# EAGLE design MidiWah (EAGLE 7.1.0)
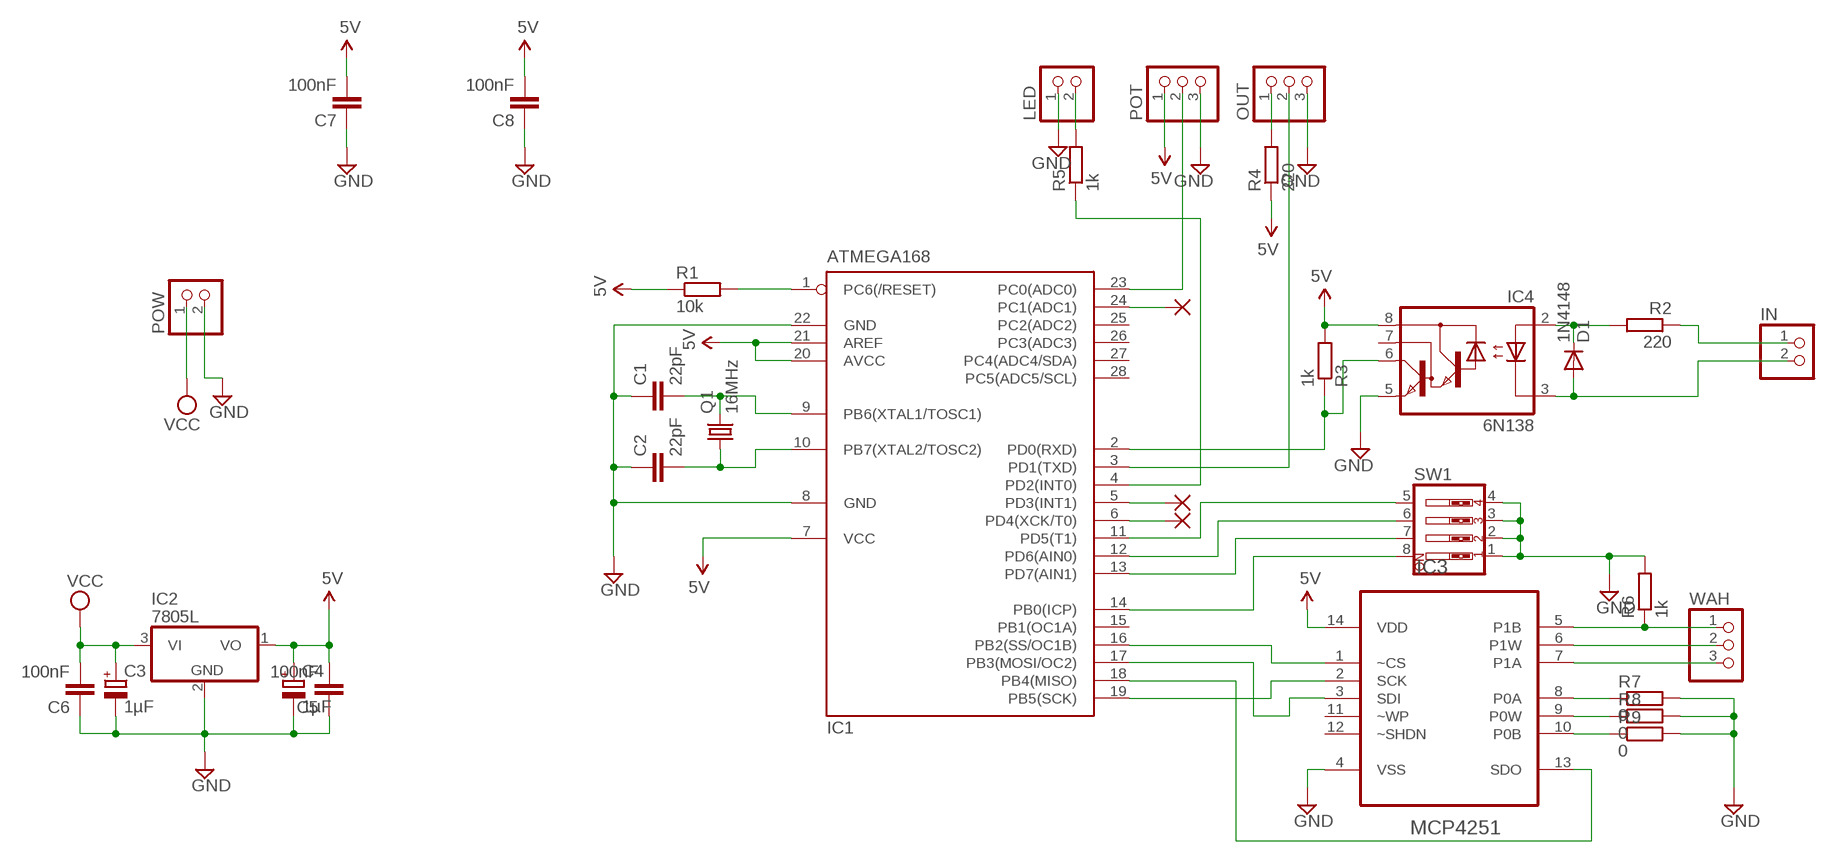
[diagram p0: schematic, sheet 1]

## Parts
C1  22pF  C-EU025-024X044  [C025-024X044]
C2  22pF  C-EU025-024X044  [C025-024X044]
C3  1µF  CPOL-EUE2.5-5  [E2,5-5]
C4  1µF  CPOL-EUE2.5-5  [E2,5-5]
C5  100nF  C-EU025-024X044  [C025-024X044]
C6  100nF  C-EU025-024X044  [C025-024X044]
C7  100nF  C-EU025-024X044  [C025-024X044]
C8  100nF  C-EU025-024X044  [C025-024X044]
D1  1N4148  1N4148DO35-7  [DO35-7]
IC1  ATMEGA168  MEGA8-P  [DIL28-3]
IC2  7805L  [TO92]
IC3  MCP4251  MCP4251-104E/P  [DIP254P762X533-14]
IC4  6N138  [DIL08]
IN  PINHD-1X2  [1X02]
LED  PINHD-1X2  [1X02]
OUT  PINHD-1X3  [1X03]
PAD1  WIREPAD1,6/0,8  [1,6/0,8]
PAD2  WIREPAD1,6/0,8  [1,6/0,8]
PAD3  WIREPAD1,6/0,8  [1,6/0,8]
POT  PINHD-1X3  [1X03]
POW  PINHD-1X2  [1X02]
Q1  16MHz  CRYSTALHC49S  [HC49/S]
R1  10k  R-EU_0204/7  [0204/7]
R2  220  R-EU_0204/7  [0204/7]
R3  1k  R-EU_0204/7  [0204/7]
R4  220  R-EU_0204/7  [0204/7]
R5  1k  R-EU_0204/7  [0204/7]
R6  1k  R-EU_0204/2V  [0204V]
R7  0  R-EU_M0805  [M0805]
R8  0  R-EU_M0805  [M0805]
R9  0  R-EU_M0805  [M0805]
SW1  SW_DIP-4  [EDG-04]
WAH  PINHD-1X3  [1X03]

## Nets
5V: C4.+ C5.2 C7.2 C8.2 IC1.7(VCC) IC1.20(AVCC) IC1.21(AREF) IC2.1(VO) IC3.14(VDD) IC4.8(VCC) POT.1 R1.1 R3.2 R4.1
GND: C1.1 C2.1 C3.- C4.- C5.1 C6.1 C7.1 C8.1 IC1.8(GND) IC1.22(GND) IC2.2(GND) IC3.4(VSS) IC4.5(GND) LED.1 OUT.3 POT.3 POW.2 R6.2 R7.2 R8.2 R9.2 SW1.1 SW1.2 SW1.3 SW1.4
N$1: IC1.1(PC6(/RESET)) R1.2
N$2: IC1.16(PB2(SS/OC1B)) IC3.1(~CS)
N$3: C1.2 IC1.9(PB6(XTAL1/TOSC1)) Q1.2
N$4: C2.2 IC1.10(PB7(XTAL2/TOSC2)) Q1.1
N$5: IC1.19(PB5(SCK)) IC3.2(SCK)
N$6: IC1.18(PB4(MISO)) IC3.13(SDO)
N$7: IC1.17(PB3(MOSI/OC2)) IC3.3(SDI)
N$8: D1.A IC4.3(C) IN.2
N$9: D1.C IC4.2(A) R2.2
N$10: IN.1 R2.1
N$11: IC1.2(PD0(RXD)) IC4.6(VO) R3.1
N$12: IC1.14(PB0(ICP)) SW1.8
N$13: IC1.13(PD7(AIN1)) SW1.7
N$14: IC1.12(PD6(AIN0)) SW1.6
N$15: IC1.11(PD5(T1)) SW1.5
N$16: IC1.23(PC0(ADC0)) POT.2
N$17: IC3.6(P1W) WAH.2
N$18: IC3.8(P0A) R7.1
N$19: IC3.7(P1A) WAH.3
N$20: IC1.3(PD1(TXD)) OUT.2
N$21: OUT.1 R4.2
N$22: LED.2 R5.2
N$23: IC1.4(PD2(INT0)) R5.1
N$24: IC3.5(P1B) R6.1 WAH.1
N$25: IC3.9(P0W) R8.1
N$26: IC3.10(P0B) R9.1
N$27: IC1.5(PD3(INT1)) PAD2.1(P)
N$28: IC1.6(PD4(XCK/T0)) PAD3.1(P)
N$29: IC1.24(PC1(ADC1)) PAD1.1(P)
VCC: C3.+ C6.2 IC2.3(VI) POW.1
Unconnected: IC1.15(PB1(OC1A)) IC1.25(PC2(ADC2)) IC1.26(PC3(ADC3)) IC1.27(PC4(ADC4/SDA)) IC1.28(PC5(ADC5/SCL)) IC3.11(~WP) IC3.12(~SHDN) IC4.7(VB)

## Library data of the parts
C1 C2 C5-C8 = rcl:C-EU: CAPACITOR, European symbol
C3 C4 = rcl:CPOL-EU: POLARIZED CAPACITOR, European symbol
D1 = diode:1N4148: DIODE high speed (Philips)
IC1 = atmel:MEGA8-P: MICROCONTROLLER 8 Kbytes FLASH, 1 kbytes SRAM, 512 bytes EEPROM, USART, 4-channel 10 bit ADC, 2-channel 8 bit ADC Pin compatible with Atmega48, ATMega88, ATMega168 Source: avr.lbr; OC_FARNELL: unknown; OC_NEWARK: unknown
IC2 = linear:78*: Positive VOLTAGE REGULATOR Source: http://cache.national.com/ds/LM/LM78L05.pdf http://www.fairchildsemi.com/ds/LM/LM7805.pdf
IC3 = Microchip_By_element14_Batch_1:MCP4251-104E/P: Digital POT; MPN: MCP4251-104E/P; OC_FARNELL: 1840692; OC_NEWARK: 27M0150; PACKAGE: DIP-14; SUPPLIER: Microchip
IC4 = optocoupler:6N138: MOTOROLA OPTO COUPLER; MF: VISHAY/TELEFUNKEN; MPN: 6N138; OC_FARNELL: 9860150; OC_NEWARK: 35K5294
IN LED POW = pinhead:PINHD-1X2: PIN HEADER
OUT POT WAH = pinhead:PINHD-1X3: PIN HEADER
PAD1-PAD3 = wirepad:WIREPAD: Wire PAD connect wire on PCB
Q1 = crystal:CRYSTAL: CRYSTAL; OC_FARNELL: 1667008; OC_NEWARK: unknown
R1-R9 = rcl:R-EU_: RESISTOR, European symbol
SW1 = special:SW_DIP-4: DIP SWITCH

## Board
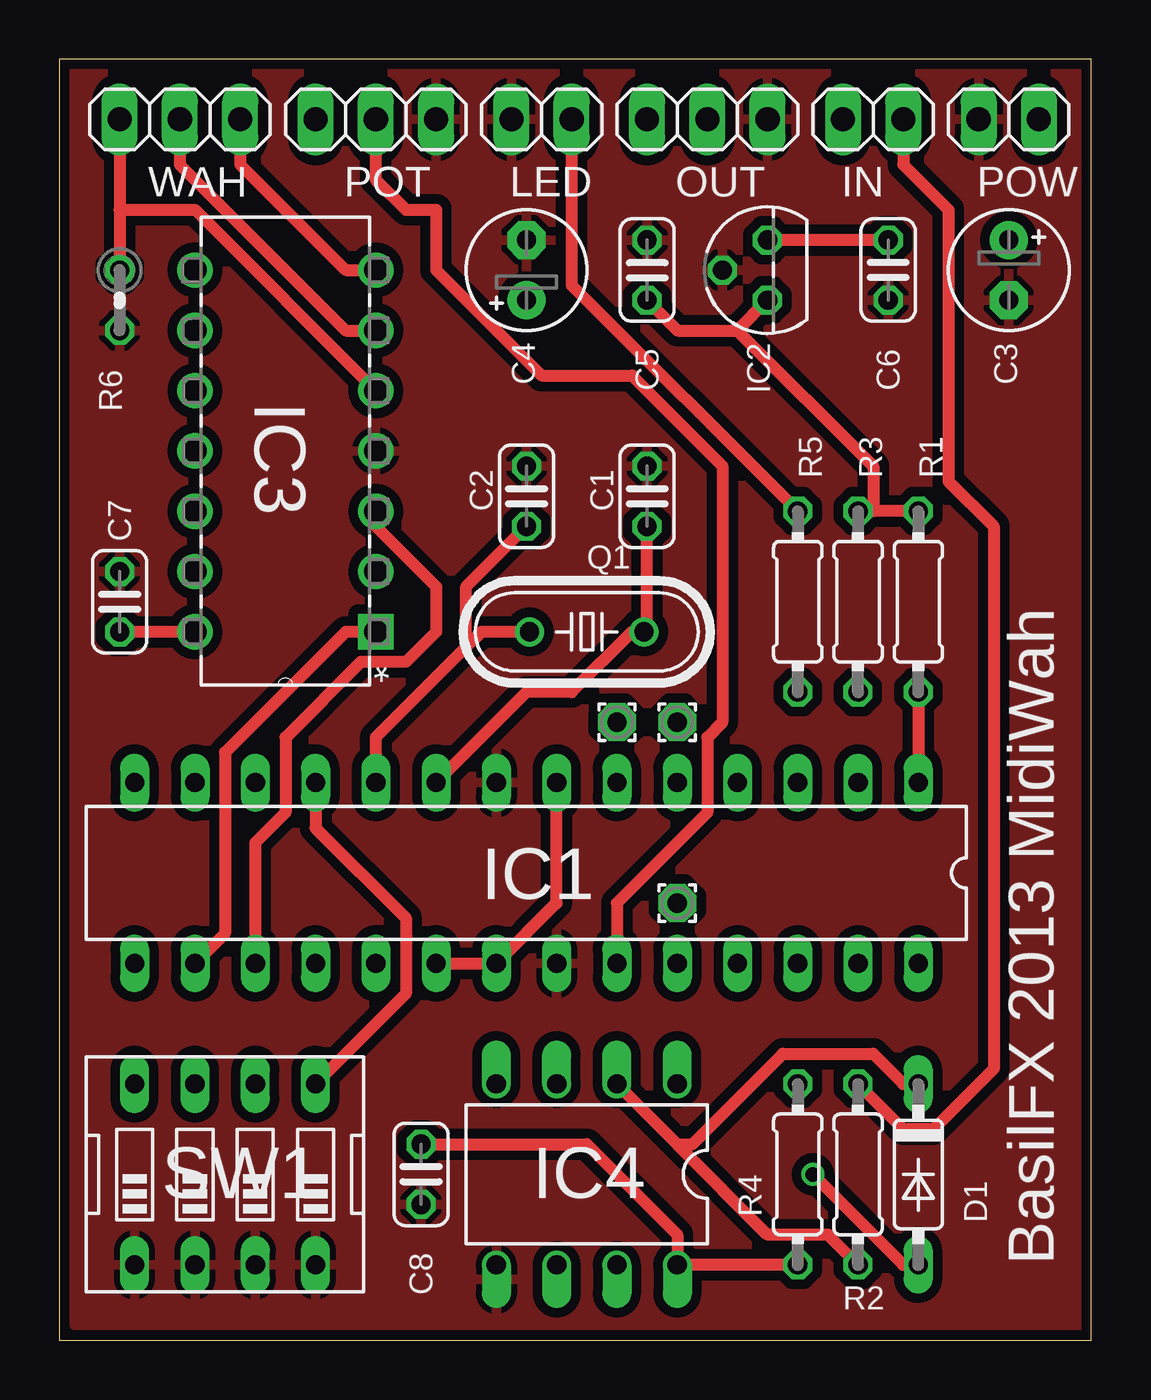
[diagram p1: board, top side]
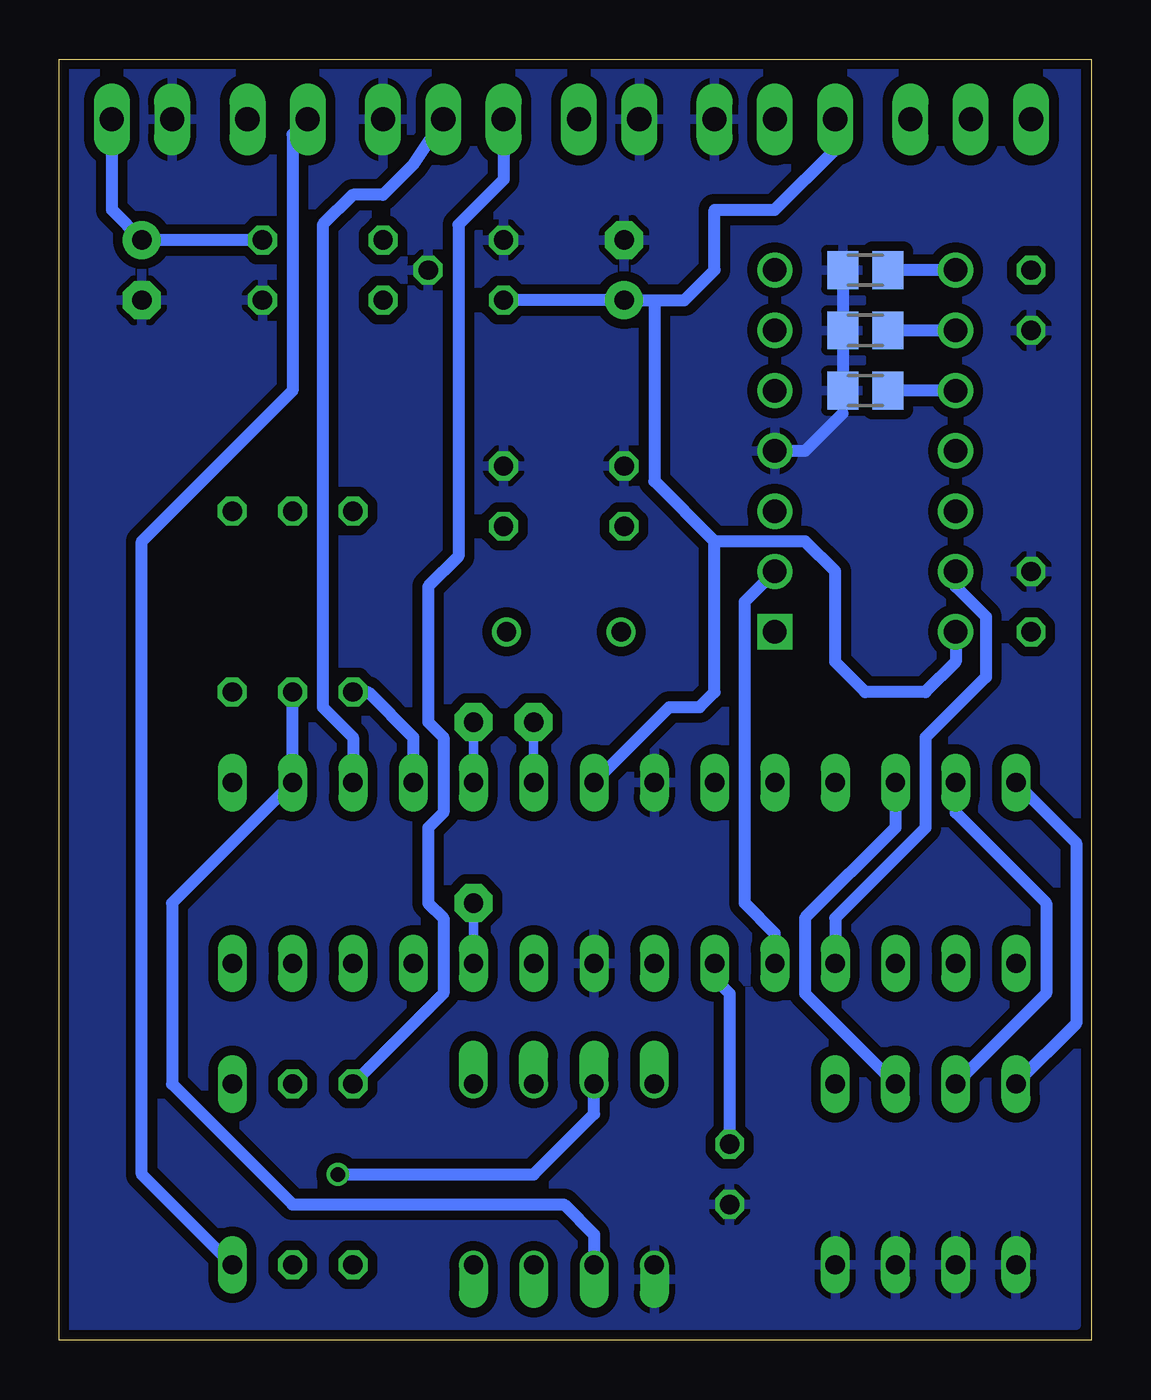
[diagram p2: board, bottom side, seen from below]

Size 43.48 x 53.97 mm. Coordinates in mm from the lower left corner, seen from the top.
Outline: 0,0 43.48,0 43.48,53.97 0,53.97 0,0
Copper layers (1*16): Top 0.0356mm / dielectric 1.5011mm / Bottom 0.0356mm
Design rules "LaenPCBOrder": minimum track width 6mil, minimum drill 13mil, track to track 6mil, track to pad 6mil, pad to pad 6mil, via to via 6mil, smd to smd 6mil, copper to edge 15mil, drill to drill 6mil, minimum pad ring 7mil, minimum via ring 7mil, stop-mask expansion 4mil, vias tented up to drill 0mil, thermal gap 10mil

### Footprints (pad centres in the part's own frame; a part is rotated, then mirrored left to right if it is on the bottom)
C025-024X044 = drill 0.813 octagon: 1 -1.27,0; 2 1.27,0
E2,5-5 = drill 0.813 pad 1.6: + -1.27,0 | drill 0.813 pad 1.6 octagon: - 1.27,0
DO35-7 = drill 0.813 long: A 3.81,0; C -3.81,0
DIL28-3 = drill 0.813 long: 1 -16.51,-3.81; 2 -13.97,-3.81; 3 -11.43,-3.81; 4 -8.89,-3.81; 5 -6.35,-3.81; 6 -3.81,-3.81; 7 -1.27,-3.81; 8 1.27,-3.81; 9 3.81,-3.81; 10 6.35,-3.81; 11 8.89,-3.81; 12 11.43,-3.81; 13 13.97,-3.81; 14 16.51,-3.81; 15 16.51,3.81; 16 13.97,3.81; 17 11.43,3.81; 18 8.89,3.81; 19 6.35,3.81; 20 3.81,3.81; 21 1.27,3.81; 22 -1.27,3.81; 23 -3.81,3.81; 24 -6.35,3.81; 25 -8.89,3.81; 26 -11.43,3.81; 27 -13.97,3.81; 28 -16.51,3.81
TO92 = drill 0.813 octagon: 1 -1.27,0; 2 0,1.905; 3 1.27,0
DIP254P762X533-14 = drill 0.991 square: 1 -7.62,15.24 | drill 0.991: 2 -7.62,12.7; 3 -7.62,10.16; 4 -7.62,7.62; 5 -7.62,5.08; 6 -7.62,2.54; 7 -7.62,0; 8 0,0; 9 0,2.54; 10 0,5.08; 11 0,7.62; 12 0,10.16; 13 0,12.7; 14 0,15.24
DIL08 = drill 0.813 offset: 1 -3.81,-3.81; 2 -1.27,-3.81; 3 1.27,-3.81; 4 3.81,-3.81; 5 3.81,3.81; 6 1.27,3.81; 7 -1.27,3.81; 8 -3.81,3.81
1X02 = drill 1.016 long: 1 -1.27,0; 2 1.27,0
1X03 = drill 1.016 long: 1 -2.54,0; 2 0,0; 3 2.54,0
1,6/0,8 = drill 0.813 pad 1.6 octagon: 1 0,0
HC49/S = drill 0.813: 1 -2.413,0; 2 2.413,0
0204/7 = drill 0.813 octagon: 1 -3.81,0; 2 3.81,0
0204V = drill 0.813 octagon: 1 -1.27,0; 2 1.27,0
M0805 = smd 1.3 x 1.6: 1 -0.95,0; 2 0.95,0
EDG-04 = drill 0.813 long: 1 -3.81,-3.81; 2 -1.27,-3.81; 3 1.27,-3.81; 4 3.81,-3.81; 5 3.81,3.81; 6 1.27,3.81; 7 -1.27,3.81; 8 -3.81,3.81

### Placement (x,y rotation side)
C1  [C025-024X044]  24.77,35.56 270 top
C2  [C025-024X044]  19.68,35.56 270 top
C3  [E2,5-5]  40.01,45.09 270 top
C4  [E2,5-5]  19.68,45.09 90 top
C5  [C025-024X044]  24.77,45.09 270 top
C6  [C025-024X044]  34.92,45.09 90 top
C7  [C025-024X044]  2.54,31.11 270 top
C8  [C025-024X044]  15.24,6.99 90 top
D1  36.2,6.99 270 top
IC1  19.68,19.68 180 top
IC2  29.84,45.09 90 top
IC3  5.71,45.09 180 top
IC4  22.23,6.99 180 top
IN  34.29,51.44 180 top
LED  20.32,51.44 0 top
OUT  27.3,51.44 0 top
PAD1  26.04,18.41 0 top
PAD2  26.04,26.04 0 top
PAD3  23.5,26.04 0 top
POT  13.34,51.44 0 top
POW  40.01,51.44 180 top
Q1  [HC49/S]  22.23,29.84 0 top
R1  [0204/7]  36.2,31.11 270 top
R2  [0204/7]  33.66,6.99 270 top
R3  [0204/7]  33.66,31.11 90 top
R4  [0204/7]  31.11,6.99 90 top
R5  [0204/7]  31.11,31.11 90 top
R6  [0204V]  2.54,43.81 270 top
R7  9.53,45.09 180 bottom
R8  9.53,42.55 180 bottom
R9  9.53,40.01 180 bottom
SW1  6.99,6.99 0 top
WAH  5.08,51.44 0 top

### Tracks (layer width: path | path; a pad name or v marks a point on that pad's centre or on a via)
5V
  Top 0.508: R1.1 34.29,34.92 | 28.57,42.55 IC2.1 | 28.57,42.55 26.04,42.55 C5.2 | 34.29,34.92 34.29,36.83 28.57,42.55 | 34.29,34.92 R3.2 | R4.1 IC4.8 26.04,4.45 22.23,8.26 C8.2 | IC3.14 C7.2 | IC1.20 IC1.21 20.95,18.41 IC1.7
  Bottom 0.508: C5.2 C4.+ 18.41,43.81 | C8.2 15.24,14.61 15.88,15.24 IC1.20 | 18.41,43.81 18.41,36.2 15.88,33.66 | IC1.7 17.78,26.67 16.51,26.67 15.88,27.3 15.88,33.66 | IC3.14 5.71,28.57 6.99,27.3 9.53,27.3 10.79,28.57 10.79,32.38 12.06,33.66 15.88,33.66 | POT.1 10.79,50.16 13.34,47.62 15.88,47.62 15.88,45.09 17.14,43.81 18.41,43.81
GND
  Bottom 0.406: R9.2 10.47,39.05
  Bottom 0.508: R7.2 R8.2 R9.2 | 10.47,39.05 12.06,37.47 IC3.4
  pour Bottom (isolate 0.406): 0.64,53.98 43.18,53.98 43.18,0.64 0.64,0.64
  pour Top (isolate 0.406): 0.64,53.98 43.18,53.98 43.18,0.64 0.64,0.64
N$1
  Top 0.508: R1.2 IC1.1
N$2
  Top 0.508: IC3.1 12.06,29.84 6.99,24.77 6.99,17.14 IC1.16
N$3
  Top 0.508: IC1.9 19.68,27.3 21.59,27.3 24.13,29.84 Q1.2 24.77,29.84 C1.2
N$4
  Top 0.508: IC1.10 13.34,25.4 17.14,29.21 | 17.14,29.21 17.78,29.84 Q1.1 | C2.2 17.14,31.75 17.14,29.21
N$5
  Bottom 0.508: IC3.2 14.61,31.11 14.61,18.41 13.34,17.14 IC1.19
N$6
  Bottom 0.508: IC1.18 10.79,17.78 6.99,21.59 6.99,25.4 4.45,27.94 4.45,30.48 5.71,31.75 IC3.13
N$7
  Top 0.508: IC1.17 8.26,20.95 9.53,22.23 9.53,25.4 12.7,28.57 14.61,28.57 15.88,29.84 15.88,31.75 13.34,34.29 IC3.3
N$8  (via drill 0.61)
  Top 0.508: v31.75,6.99 35.56,3.17 D1.A
  Bottom 0.508: IC4.3 20.95,9.53 23.5,6.99 v31.75,6.99 | D1.A 40.01,6.99 40.01,33.66 33.66,40.01 33.66,50.8 IN.2
N$9
  Top 0.508: 26.04,8.26 29.84,4.45 32.38,4.45 R2.2 | 26.04,8.26 IC4.2 | D1.C 35.56,10.79 34.29,12.06 30.48,12.06 26.67,8.26 26.04,8.26
N$10
  Top 0.508: R2.1 35.56,8.89 36.83,8.89 39.37,11.43 39.37,34.29 37.47,36.2 37.47,47.62 35.56,49.53 IN.1
N$11
  Bottom 0.508: IC4.6 20.95,4.45 22.23,5.71 33.66,5.71 38.73,10.79 38.73,18.41 IC1.2 R3.1
N$12
  Bottom 0.508: SW1.8 0.64,13.34 0.64,20.95 IC1.14
N$13
  Bottom 0.508: SW1.7 1.91,14.61 1.91,18.41 5.71,22.23 IC1.13
N$14
  Bottom 0.508: SW1.6 12.06,14.61 12.06,17.78 8.26,21.59 IC1.12
N$15
  Top 0.508: SW1.5 14.61,14.61 14.61,17.78 10.79,21.59 IC1.11
N$16
  Top 0.508: IC1.23 23.5,18.41 27.3,22.23 27.3,25.4 27.94,26.04 27.94,36.83 24.13,40.64 20.32,40.64 15.88,45.09 15.88,47.62 14.61,47.62 13.34,48.9 POT.2
N$17
  Top 0.508: WAH.2 5.08,49.53 12.06,42.55 IC3.6
N$18
  Bottom 0.508: IC3.8 R7.1
N$19
  Top 0.508: WAH.3 7.62,49.53 12.06,45.09 IC3.7
N$20
  Bottom 0.508: IC1.3 31.11,25.4 32.38,26.67 32.38,46.99 31.11,48.26 29.84,48.26 28.57,49.53 OUT.2
N$21
  Bottom 0.508: R4.2 27.3,14.61 27.3,17.78 27.94,18.41 27.94,21.59 27.3,22.23 27.3,25.4 27.94,26.04 27.94,31.75 26.67,33.02 26.67,46.99 24.77,48.9 OUT.1
N$22
  Top 0.508: R5.2 21.59,44.45 LED.2
N$23
  Bottom 0.508: IC1.4 28.57,25.4 30.48,27.3 R5.1
N$24
  Top 0.508: WAH.1 2.54,47.62 | 2.54,47.62 R6.1 | IC3.5 5.71,47.62 2.54,47.62
N$25
  Bottom 0.508: IC3.9 R8.1
N$26
  Bottom 0.508: IC3.10 R9.1
N$27
  Bottom 0.406: IC1.5 PAD2.1
N$28
  Bottom 0.406: IC1.6 PAD3.1
N$29
  Bottom 0.406: PAD1.1 IC1.24
VCC
  Top 0.508: C6.2 IC2.3
  Bottom 0.508: C6.2 C3.+ 41.27,47.62 POW.1

### Text on the board
tNames: BasilFX 2013 MidiWah